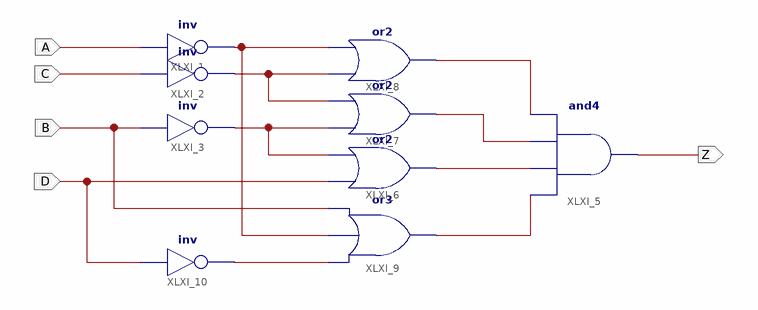
[diagram p0: schematic sheet 1]
// Xilinx ISE schematic p1ej2b.sch (spartan3) as structural Verilog: 9 symbols, 5 ports
module p1ej2b (
  input  A,
  input  C,
  input  B,
  input  D,
  output Z
);

  wire XLXN_1, XLXN_4, XLXN_6, XLXN_12, XLXN_13, XLXN_14, XLXN_15, XLXN_16;

  not XLXI_1 (XLXN_1, A);
  not XLXI_2 (XLXN_4, C);
  not XLXI_3 (XLXN_6, B);
  and XLXI_5 (Z, XLXN_15, XLXN_14, XLXN_13, XLXN_12);
  or XLXI_6 (XLXN_14, D, XLXN_6);
  or XLXI_7 (XLXN_13, XLXN_6, XLXN_4);
  or XLXI_8 (XLXN_12, XLXN_4, XLXN_1);
  or XLXI_9 (XLXN_15, XLXN_16, XLXN_1, B);
  not XLXI_10 (XLXN_16, D);
endmodule
